# EAGLE design guitar_pedal (EAGLE 6.5.0)

## Sheet 1 of 5: Input
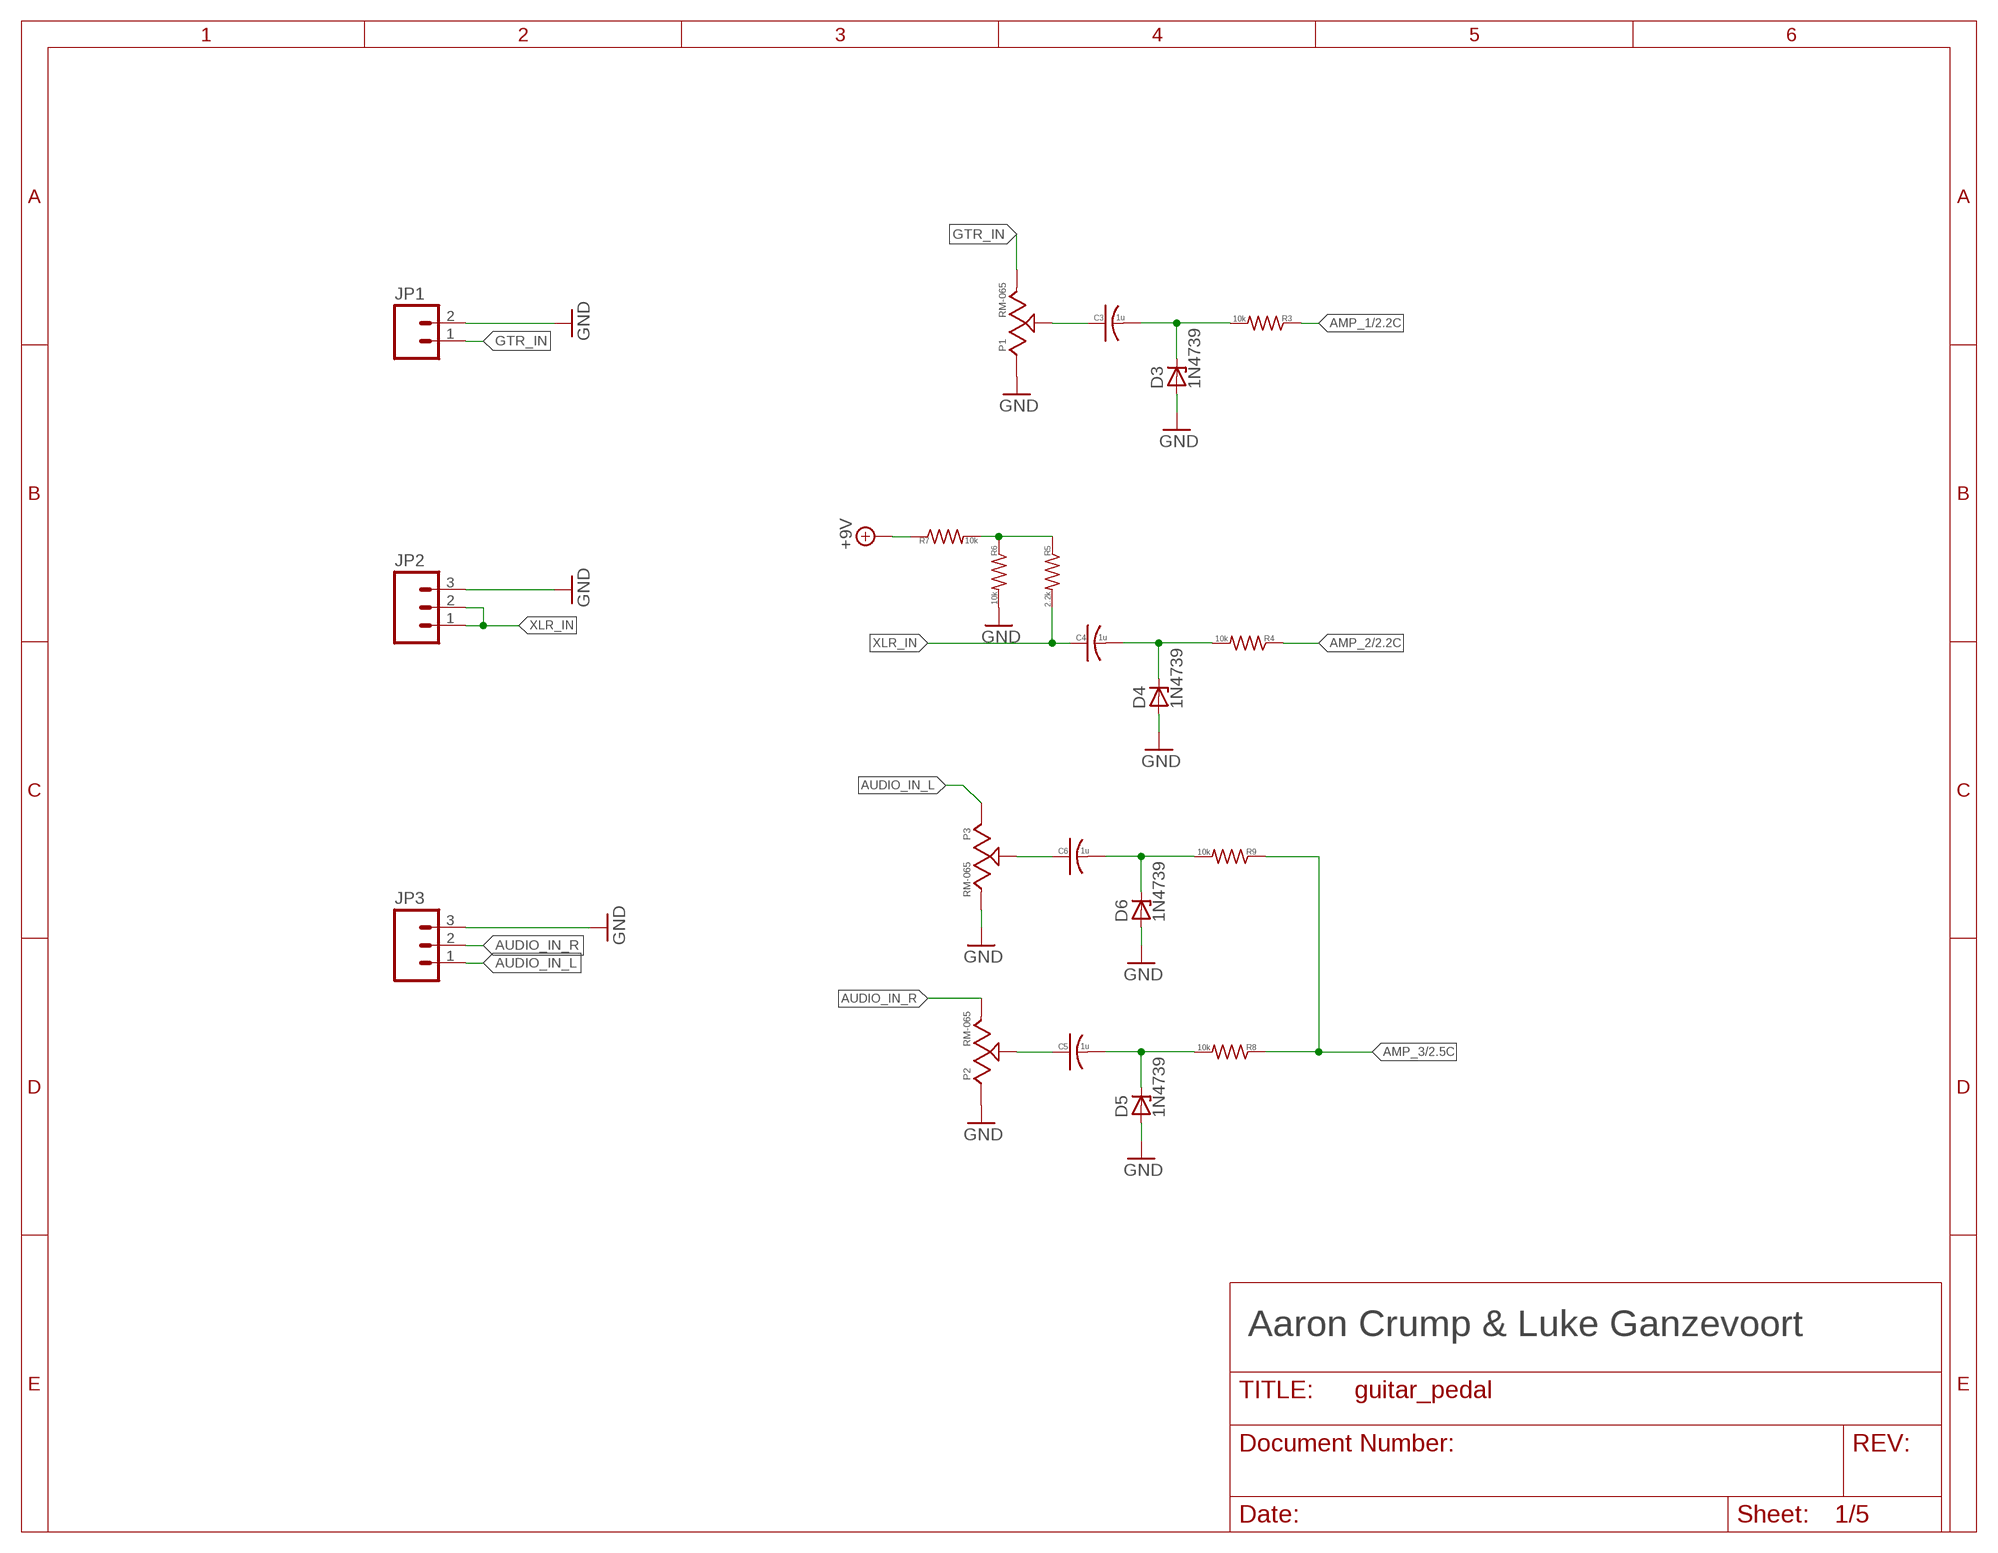
[diagram p0: schematic, sheet 1]

### Parts
C3  1u  CAPACITOR0805  [C0805]
C4  1u  CAPACITOR0805  [C0805]
C5  1u  CAPACITOR0805  [C0805]
C6  1u  CAPACITOR0805  [C0805]
D3  1N4739  1N4728  [DO41-7]
D4  1N4739  1N4728  [DO41-7]
D5  1N4739  1N4728  [DO41-7]
D6  1N4739  1N4728  [DO41-7]
JP1  M02PTH  [1X02]
JP2  M03PTH  [1X03]
JP3  M03PTH  [1X03]
P1  RM-065  [RM-065]
P2  RM-065  [RM-065]
P3  RM-065  [RM-065]
R3  10k  RESISTOR0805  [C0805]
R4  10k  RESISTOR0805  [C0805]
R5  2.2k  RESISTOR0805  [C0805]
R6  10k  RESISTOR0805  [C0805]
R7  10k  RESISTOR0805  [C0805]
R8  10k  RESISTOR0805  [C0805]
R9  10k  RESISTOR0805  [C0805]

### Nets
+9V: R7.1 ; also sheet 2,3,4,5
AMP_1: R3.1 ; also sheet 2
AMP_2: R4.1 ; also sheet 2
AMP_3: R8.1 R9.1 ; also sheet 2
AUDIO_IN_L: JP3.1 P3.1
AUDIO_IN_R: JP3.2 P2.3
GND: D3.A D4.A D5.A D6.A JP1.2 JP2.3 JP3.3 P1.1 P2.1 P3.3 R6.2 ; also sheet 2,3,4,5
GTR_IN: JP1.1 P1.3
N$2: C5.1(POS) P2.2(W)
N$3: R5.1 R6.1 R7.2
N$4: C3.1(POS) P1.2(W)
N$6: C6.1(POS) P3.2(W)
N$24: C4.2(NEG) D4.C R4.2
N$30: C6.2(NEG) D6.C R9.2
N$33: C5.2(NEG) D5.C R8.2
N$37: C3.2(NEG) D3.C R3.2
XLR_IN: C4.1(POS) JP2.1 JP2.2 R5.2

### Notes on the sheet
- Aaron Crump & Luke Ganzevoort

## Sheet 2 of 5: Summing
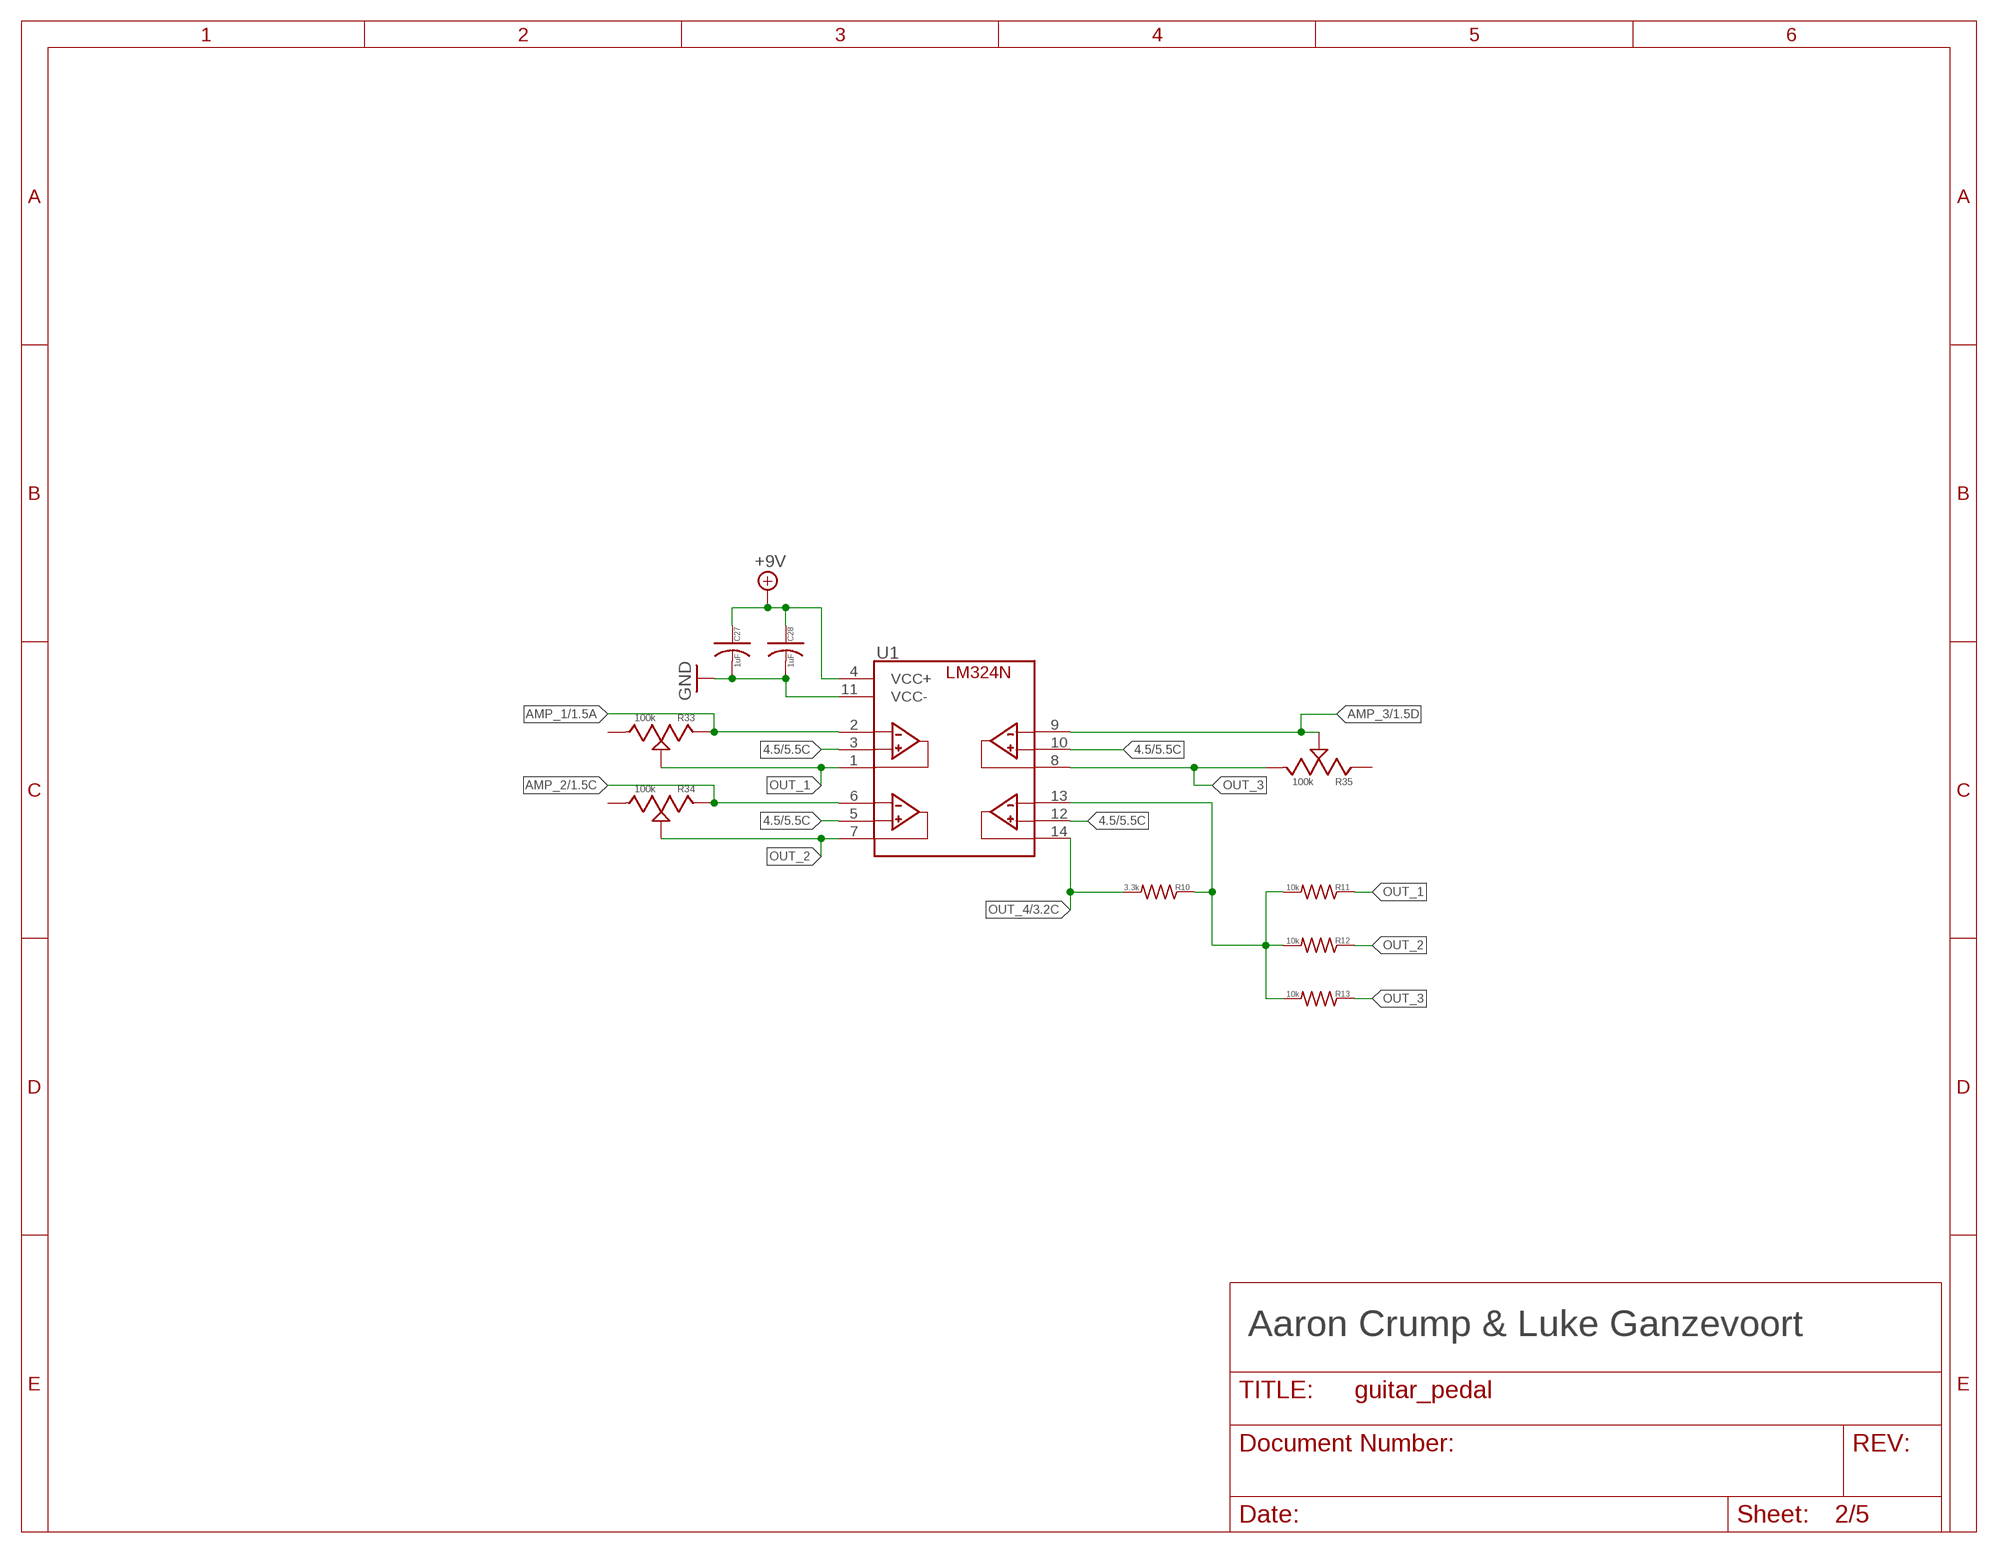
[diagram p1: schematic, sheet 2]

### Parts
C27  1uF  CAPACITOR0805  [C0805]
C28  1uF  CAPACITOR0805  [C0805]
R10  3.3k  RESISTOR0805  [C0805]
R11  10k  RESISTOR0805  [C0805]
R12  10k  RESISTOR0805  [C0805]
R13  10k  RESISTOR0805  [C0805]
R33  100k  POT  [1X03_LONGPADS]
R34  100k  POT  [1X03_LONGPADS]
R35  100k  POT  [1X03_LONGPADS]
U1  LM324NSOIC-14  [SOIC-14]

### Nets
4.5: U1.3(NINV_IN_1) U1.5(NINV_IN_2) U1.10(NINV_3) U1.12(NINV_4) ; also sheet 5
+9V: C27.1(POS) C28.1(POS) U1.4(VCC+) ; also sheet 1,3,4,5
AMP_1: R33.1 U1.2(INV_IN_1) ; also sheet 1
AMP_2: R34.1 U1.6(INV_IN_2) ; also sheet 1
AMP_3: R35.2(W) U1.9(INV_3) ; also sheet 1
GND: C27.2(NEG) C28.2(NEG) U1.11(VCC-) ; also sheet 1,3,4,5
N$7: R10.1 R11.2 R12.2 R13.2 U1.13(INV_4)
OUT_1: R11.1 R33.2(W) U1.1(OUT_1)
OUT_2: R12.1 R34.2(W) U1.7(OUT_2)
OUT_3: R13.1 R35.3 U1.8(OUT_3)
OUT_4: R10.2 U1.14(OUT_4) ; also sheet 3
Unconnected: R33.3 R34.3 R35.1

### Notes on the sheet
- Aaron Crump & Luke Ganzevoort

## Sheet 3 of 5: EQ
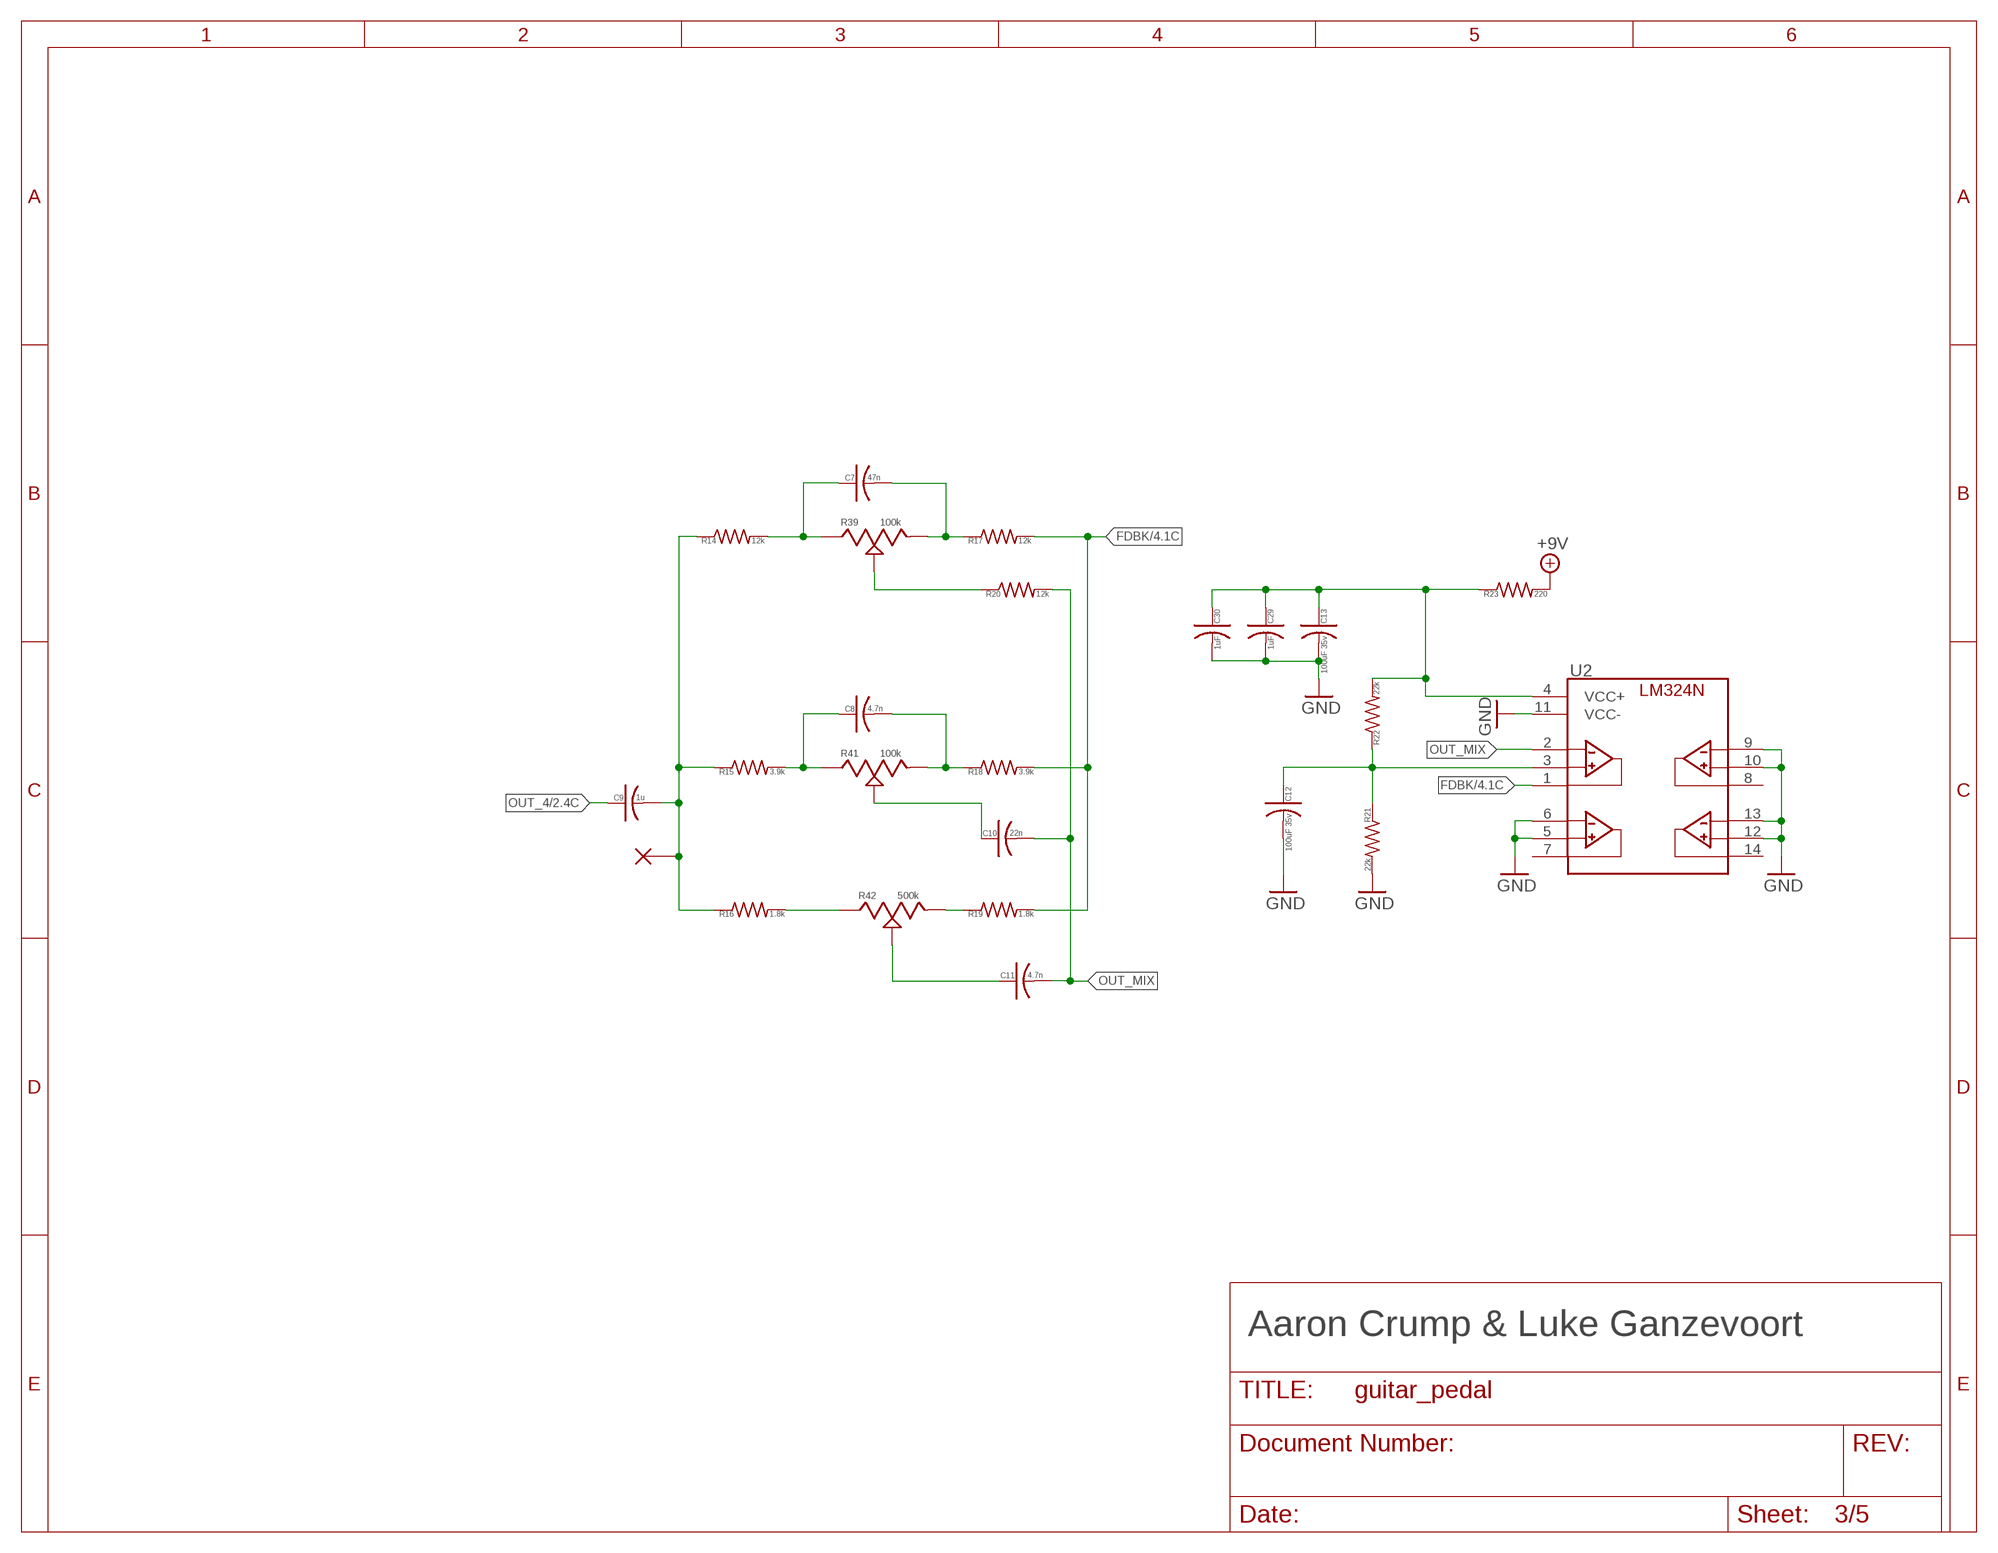
[diagram p2: schematic, sheet 3]

### Parts
C7  47n  CAPACITOR0805  [C0805]
C8  4.7n  CAPACITOR0805  [C0805]
C9  1u  CAPACITOR0805  [C0805]
C10  22n  CAPACITOR0805  [C0805]
C11  4.7n  CAPACITOR0805  [C0805]
C12  100uF 35v  CAPACITORCAN_6MM  [CAN_6MM]
C13  100uF 35v  CAPACITORCAN_6MM  [CAN_6MM]
C29  1uF  CAPACITOR0805  [C0805]
C30  1uF  CAPACITOR0805  [C0805]
R14  12k  RESISTOR0805  [C0805]
R15  3.9k  RESISTOR0805  [C0805]
R16  1.8k  RESISTOR0805  [C0805]
R17  12k  RESISTOR0805  [C0805]
R18  3.9k  RESISTOR0805  [C0805]
R19  1.8k  RESISTOR0805  [C0805]
R20  12k  RESISTOR0805  [C0805]
R21  22k  RESISTOR0805  [C0805]
R22  22k  RESISTOR0805  [C0805]
R23  220  RESISTOR0805  [C0805]
R39  100k  POT  [1X03_LONGPADS]
R41  100k  POT  [1X03_LONGPADS]
R42  500k  POT  [1X03_LONGPADS]
U2  LM324NSOIC-14  [SOIC-14]
V2  EQin  VIA1  [VIA1]

### Nets
+9V: R23.2 ; also sheet 1,2,4,5
FDBK: R17.2 R18.2 R19.2 U2.1(OUT_1) ; also sheet 4
GND: C12.P-(NEG) C13.P-(NEG) C29.2(NEG) C30.2(NEG) R21.2 U2.5(NINV_IN_2) U2.6(INV_IN_2) U2.9(INV_3) U2.10(NINV_3) U2.11(VCC-) U2.12(NINV_4) U2.13(INV_4) ; also sheet 1,2,4,5
N$5: C13.P+(POS) C29.1(POS) C30.1(POS) R22.2 R23.1 U2.4(VCC+)
N$9: C7.1(POS) R14.2 R39.1
N$10: C8.1(POS) R15.2 R41.1
N$11: R16.2 R42.1
N$12: C9.2(NEG) R14.1 R15.1 R16.1 V2.P$1
N$13: C11.1(POS) R42.2(W)
N$15: C7.2(NEG) R17.1 R39.3
N$16: C8.2(NEG) R18.1 R41.3
N$17: R19.1 R42.3
N$18: R20.1 R39.2(W)
N$19: C10.1(POS) R41.2(W)
N$26: C12.P+(POS) R21.1 R22.1 U2.3(NINV_IN_1)
OUT_4: C9.1(POS) ; also sheet 2
OUT_MIX: C10.2(NEG) C11.2(NEG) R20.2 U2.2(INV_IN_1)
Unconnected: U2.7(OUT_2) U2.8(OUT_3) U2.14(OUT_4)

### Notes on the sheet
- Aaron Crump & Luke Ganzevoort

## Sheet 4 of 5: Outputs
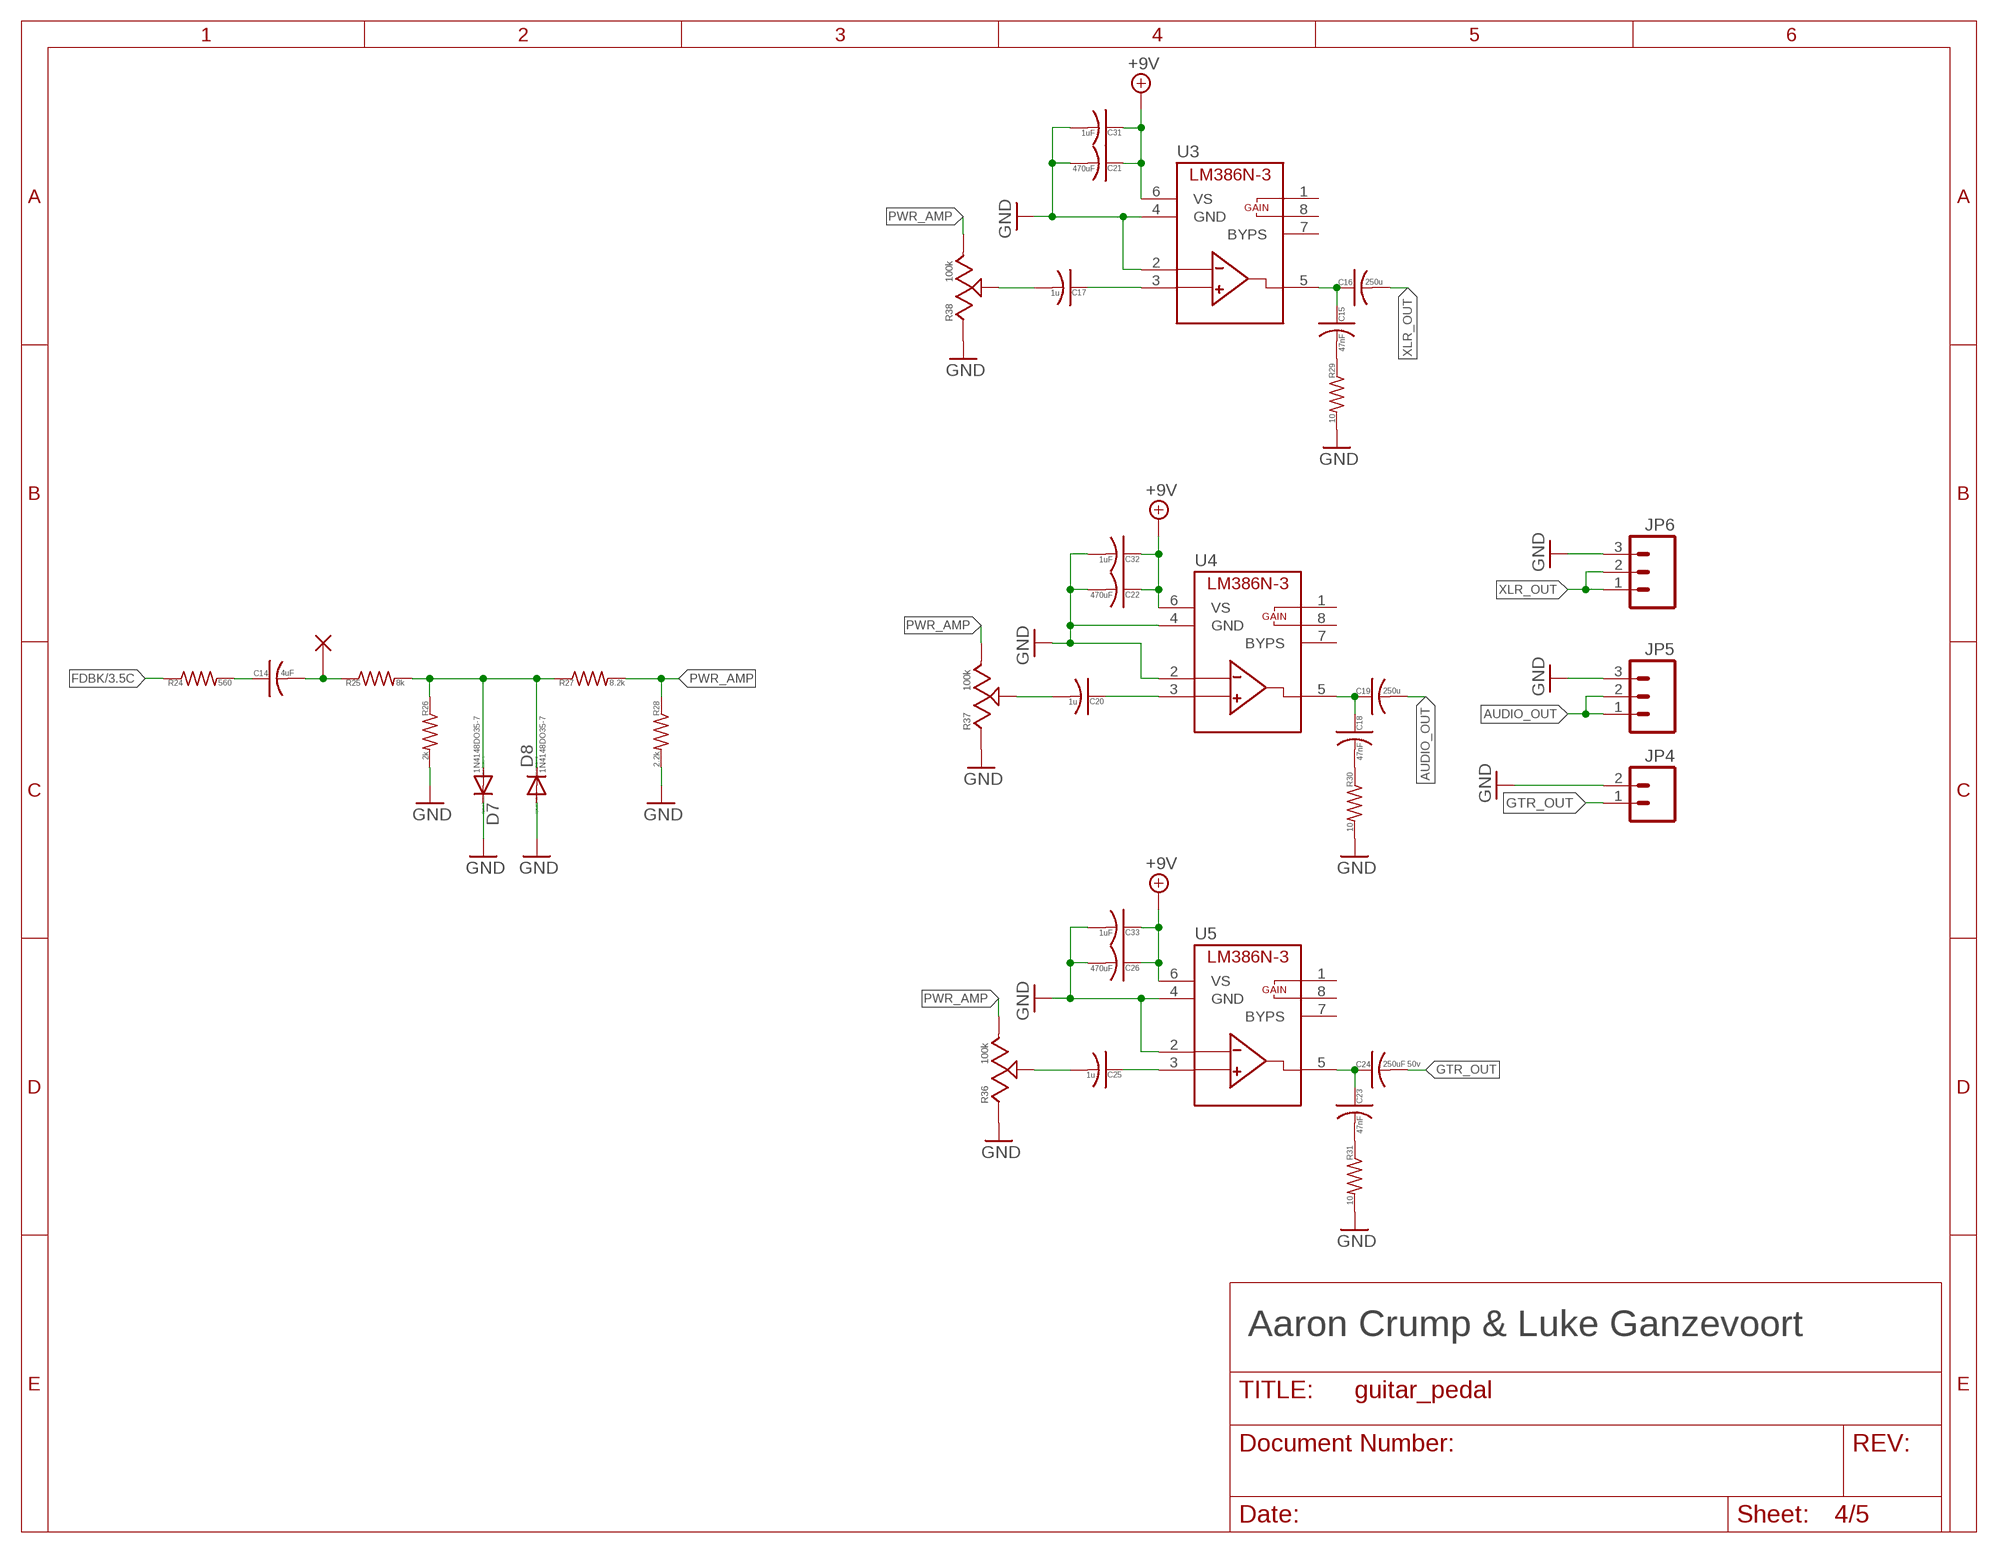
[diagram p3: schematic, sheet 4]

### Parts
C14  4uF  CAPACITOR0805  [C0805]
C15  47nF  CAPACITOR0805  [C0805]
C16  250u  CAP_CAN01  [CAN01]
C17  1u  CAPACITOR0805  [C0805]
C18  47nF  CAPACITOR0805  [C0805]
C19  250u  CAP_CAN01  [CAN01]
C20  1u  CAPACITOR0805  [C0805]
C21  470uF  CAP_CAN01  [CAN01]
C22  470uF  CAP_CAN01  [CAN01]
C23  47nF  CAPACITOR0805  [C0805]
C24  250uF 50v  CAP_CAN01  [CAN01]
C25  1u  CAPACITOR0805  [C0805]
C26  470uF  CAP_CAN01  [CAN01]
C31  1uF  CAPACITOR0805  [C0805]
C32  1uF  CAPACITOR0805  [C0805]
C33  1uF  CAPACITOR0805  [C0805]
D7  1N4148DO35-7  [DO35-7]
D8  1N4148DO35-7  [DO35-7]
JP4  M02PTH  [1X02]
JP5  M03PTH  [1X03]
JP6  M03PTH  [1X03]
R24  560  RESISTOR0805  [C0805]
R25  8k  RESISTOR0805  [C0805]
R26  2k  RESISTOR0805  [C0805]
R27  8.2k  RESISTOR0805  [C0805]
R28  2.2k  RESISTOR0805  [C0805]
R29  10  RESISTOR0805  [C0805]
R30  10  RESISTOR0805  [C0805]
R31  10  RESISTOR0805  [C0805]
R36  100k  POT  [1X03_LONGPADS]
R37  100k  POT  [1X03_LONGPADS]
R38  100k  POT  [1X03_LONGPADS]
U3  LM386N-3  [DIL08]
U4  LM386N-3  [DIL08]
U5  LM386N-3  [DIL08]
V17  EQout  VIA1  [VIA1]

### Nets
+9V: C21.+(POS) C22.+(POS) C26.+(POS) C31.1(POS) C32.1(POS) C33.1(POS) U3.6(VS) U4.6(VS) U5.6(VS) ; also sheet 1,2,3,5
AUDIO_OUT: C19.-(NEG) JP5.1 JP5.2
FDBK: R24.1 ; also sheet 3
GND: C21.-(NEG) C22.-(NEG) C26.-(NEG) C31.2(NEG) C32.2(NEG) C33.2(NEG) D7.C D8.A JP4.2 JP5.3 JP6.3 R26.2 R28.2 R29.2 R30.2 R31.2 R36.1 R37.1 R38.1 U3.2(-IN) U3.4(GND) U4.2(-IN) U4.4(GND) U5.2(-IN) U5.4(GND) ; also sheet 1,2,3,5
GTR_OUT: C24.-(NEG) JP4.1
N$8: C15.1(POS) C16.+(POS) U3.5(VOUT)
N$14: C14.1(POS) R24.2
N$20: C14.2(NEG) R25.1 V17.P$1
N$21: D7.A D8.C R25.2 R26.1 R27.1
N$22: C15.2(NEG) R29.1
N$23: C17.2(NEG) R38.2(W)
N$25: C18.1(POS) C19.+(POS) U4.5(VOUT)
N$27: C20.1(POS) U4.3(+IN)
N$28: C17.1(POS) U3.3(+IN)
N$29: C18.2(NEG) R30.1
N$31: C20.2(NEG) R37.2(W)
N$34: C23.1(POS) C24.+(POS) U5.5(VOUT)
N$35: C25.1(POS) U5.3(+IN)
N$36: C23.2(NEG) R31.1
N$38: C25.2(NEG) R36.2(W)
PWR_AMP: R27.2 R28.1 R36.3 R37.3 R38.3
XLR_OUT: C16.-(NEG) JP6.1 JP6.2
Unconnected: U3.1(GN) U3.7(BYPS) U3.8(GN2) U4.1(GN) U4.7(BYPS) U4.8(GN2) U5.1(GN) U5.7(BYPS) U5.8(GN2)

### Notes on the sheet
- Aaron Crump & Luke Ganzevoort

## Sheet 5 of 5: Power
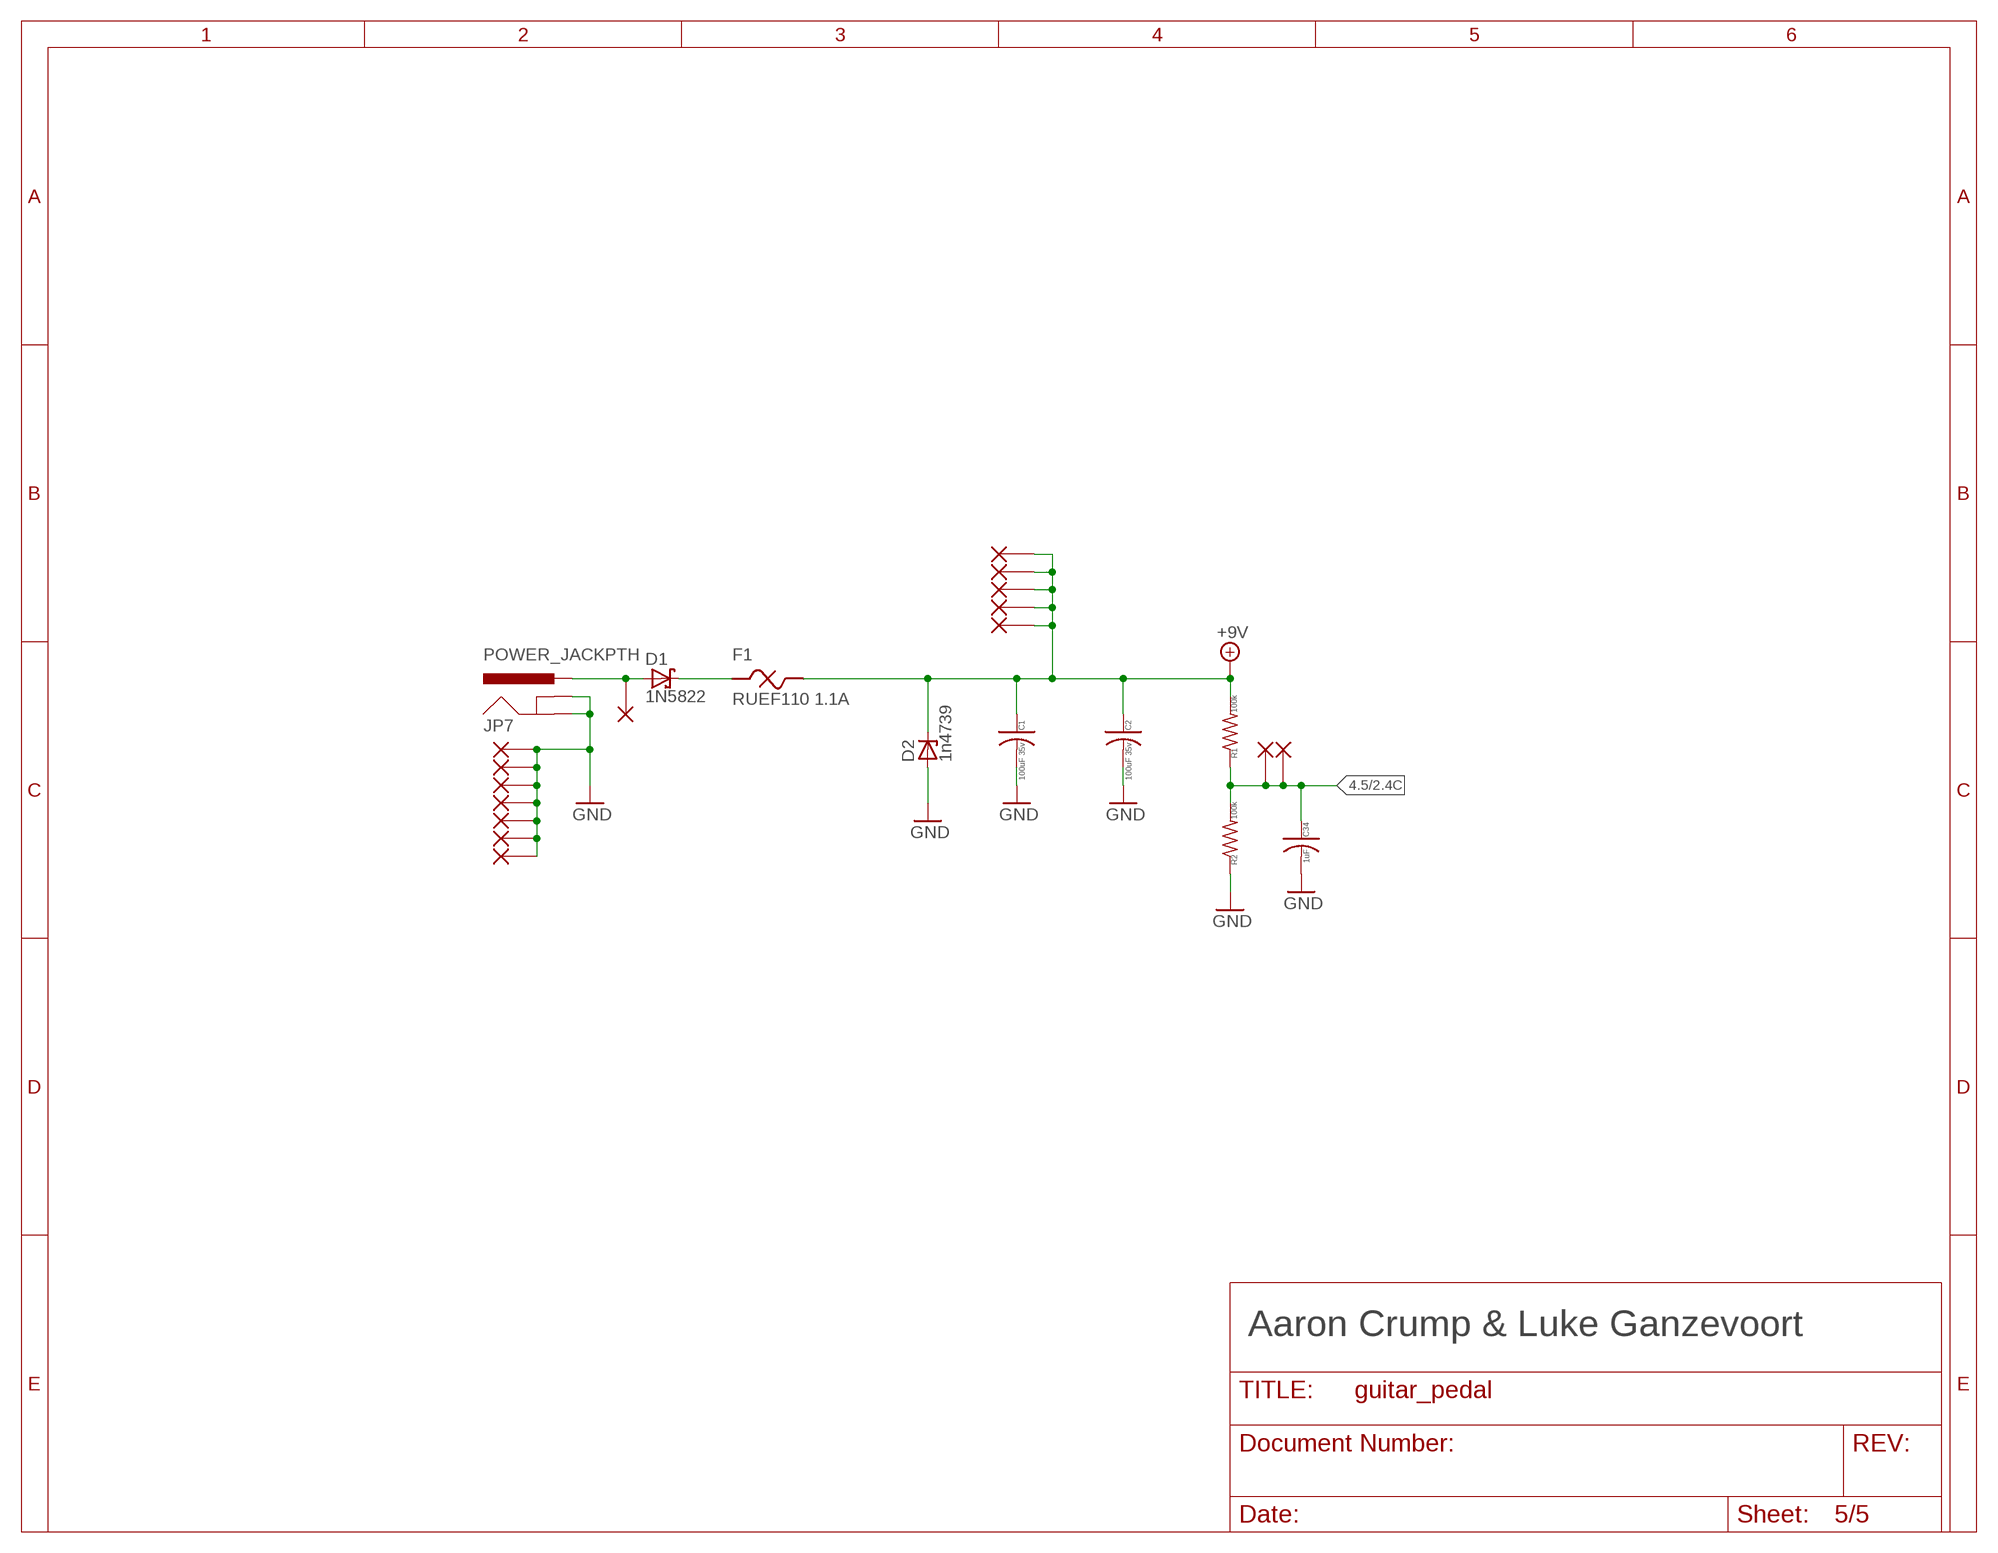
[diagram p4: schematic, sheet 5]

### Parts
C1  100uF 35v  CAPACITORCAN_6MM  [CAN_6MM]
C2  100uF 35v  CAPACITORCAN_6MM  [CAN_6MM]
C34  1uF  CAPACITOR0805  [C0805]
D1  1N5822  [DO201T15]
D2  1n4739  1N4728  [DO41-7]
F1  RUEF110 1.1A  PTCRUEF110  [RADIAL_PTC_RUEF110]
JP7  POWER_JACKPTH  [POWER_JACK_PTH]
R1  100k  RESISTOR0805  [C0805]
R2  100k  RESISTOR0805  [C0805]
V1  V+  VIA1  [VIA1]
V3  9v  VIA1  [VIA1]
V4  9v  VIA1  [VIA1]
V5  9v  VIA1  [VIA1]
V6  9v  VIA1  [VIA1]
V7  9v  VIA1  [VIA1]
V8  4v5  VIA1  [VIA1]
V9  4v5  VIA1  [VIA1]
V10  GND  VIA1  [VIA1]
V11  GND  VIA1  [VIA1]
V12  GND  VIA1  [VIA1]
V13  GND  VIA1  [VIA1]
V14  GND  VIA1  [VIA1]
V15  GND  VIA1  [VIA1]
V16  GND  VIA1  [VIA1]

### Nets
4.5: C34.1(POS) R1.1 R2.2 V8.P$1 V9.P$1 ; also sheet 2
+9V: C1.P+(POS) C2.P+(POS) D2.C F1.P$2 R1.2 V3.P$1 V4.P$1 V5.P$1 V6.P$1 V7.P$1 ; also sheet 1,2,3,4
GND: C1.P-(NEG) C2.P-(NEG) C34.2(NEG) D2.A JP7.GND JP7.GNDBREAK R2.1 V10.P$1 V11.P$1 V12.P$1 V13.P$1 V14.P$1 V15.P$1 V16.P$1 ; also sheet 1,2,3,4
N$1: D1.A JP7.PWR V1.P$1
N$32: D1.C F1.P$1

### Notes on the sheet
- Aaron Crump & Luke Ganzevoort

## Library data of the parts
C1-C15 C17 C18 C20 C23 C25 C27-C34 = Luke:CAPACITOR
C16 C19 C21 C22 C24 C26 = Luke:CAP_CAN01
D1 = aarons:1N5822
D2-D6 = aarons:1N4728
D7 D8 = diode:1N4148: DIODE high speed (Philips)
F1 = Luke:PTC
JP1 JP4 = SparkFun-Connectors:M02: Standard 2-pin 0.1" header. Use with - straight break away headers ( PRT-00116) - right angle break away headers (PRT-00553) - swiss pins (PRT-00743) - machine pins (PRT-00117) - female headers (PRT-00115) Molex polarized connector foot print use with: PRT-08233 with associated crimp pins and housings. 2.54_SCREWTERM for use with PRT-10571. 3.5mm Screw Terminal footprints for PRT-08084 5mm Screw Terminal footprints for use with PRT-08432
JP2 JP3 JP5 JP6 = SparkFun-Connectors:M03: Header 3 Standard 3-pin 0.1" header. Use with straight break away headers (SKU : PRT-00116), right angle break away headers (PRT-00553), swiss pins (PRT-00743), machine pins (PRT-00117), and female headers (PRT-00115). Molex polarized connector foot print use with SKU : PRT-08232 with associated crimp pins and housings.
JP7 = SparkFun-Connectors:POWER_JACK: Power Jack This is the standard 5.5mm barrel jack for power. The PTH is the most common, proven, reliable, footprint. The Slot footprint only works if the mill layer is transmitted to the PCB fab house so be warned. Mating wall wart : TOL-00298 (and others); PROD_ID: CONN-08197
P1-P3 = aarons:RM-065
R1-R31 = Luke:RESISTOR
R33-R39 R41 R42 = aarons:POT
U1 U2 = aarons:LM324N
U3-U5 = aarons:LM386N-3
V1-V17 = Luke:VIA1

## Board
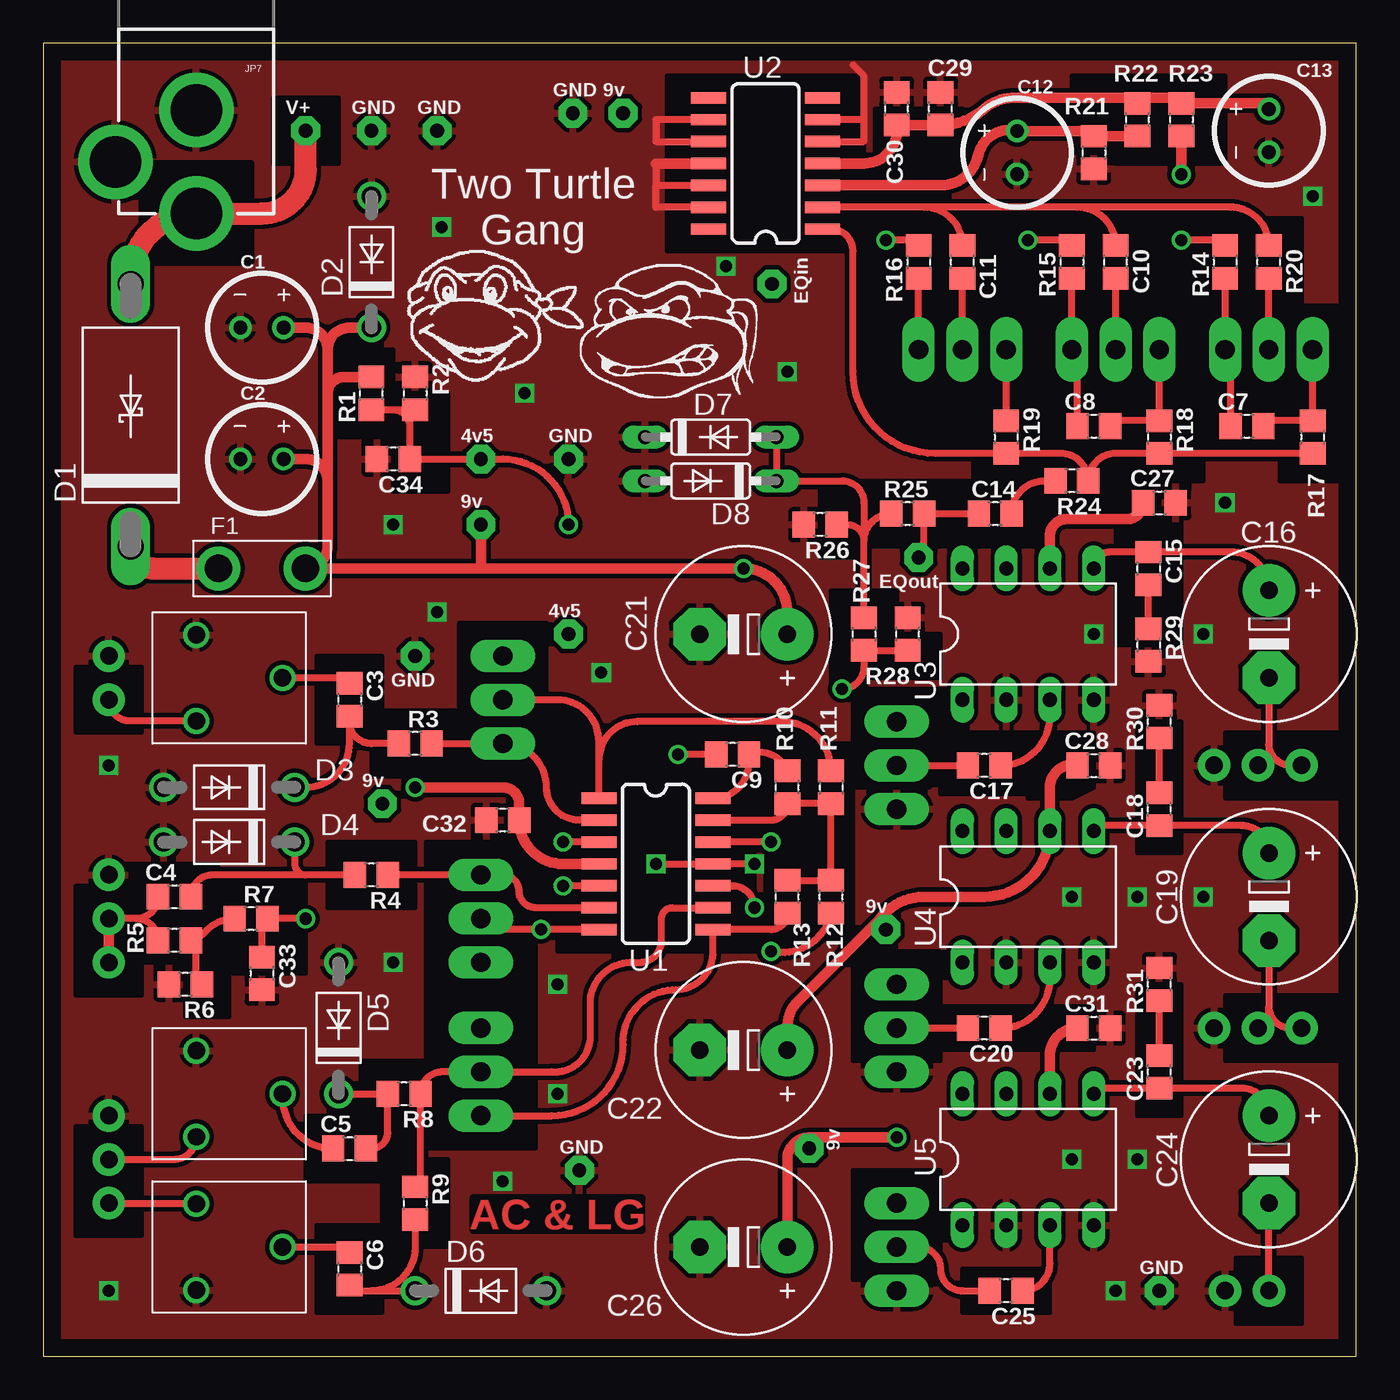
[diagram p5: board, top side]
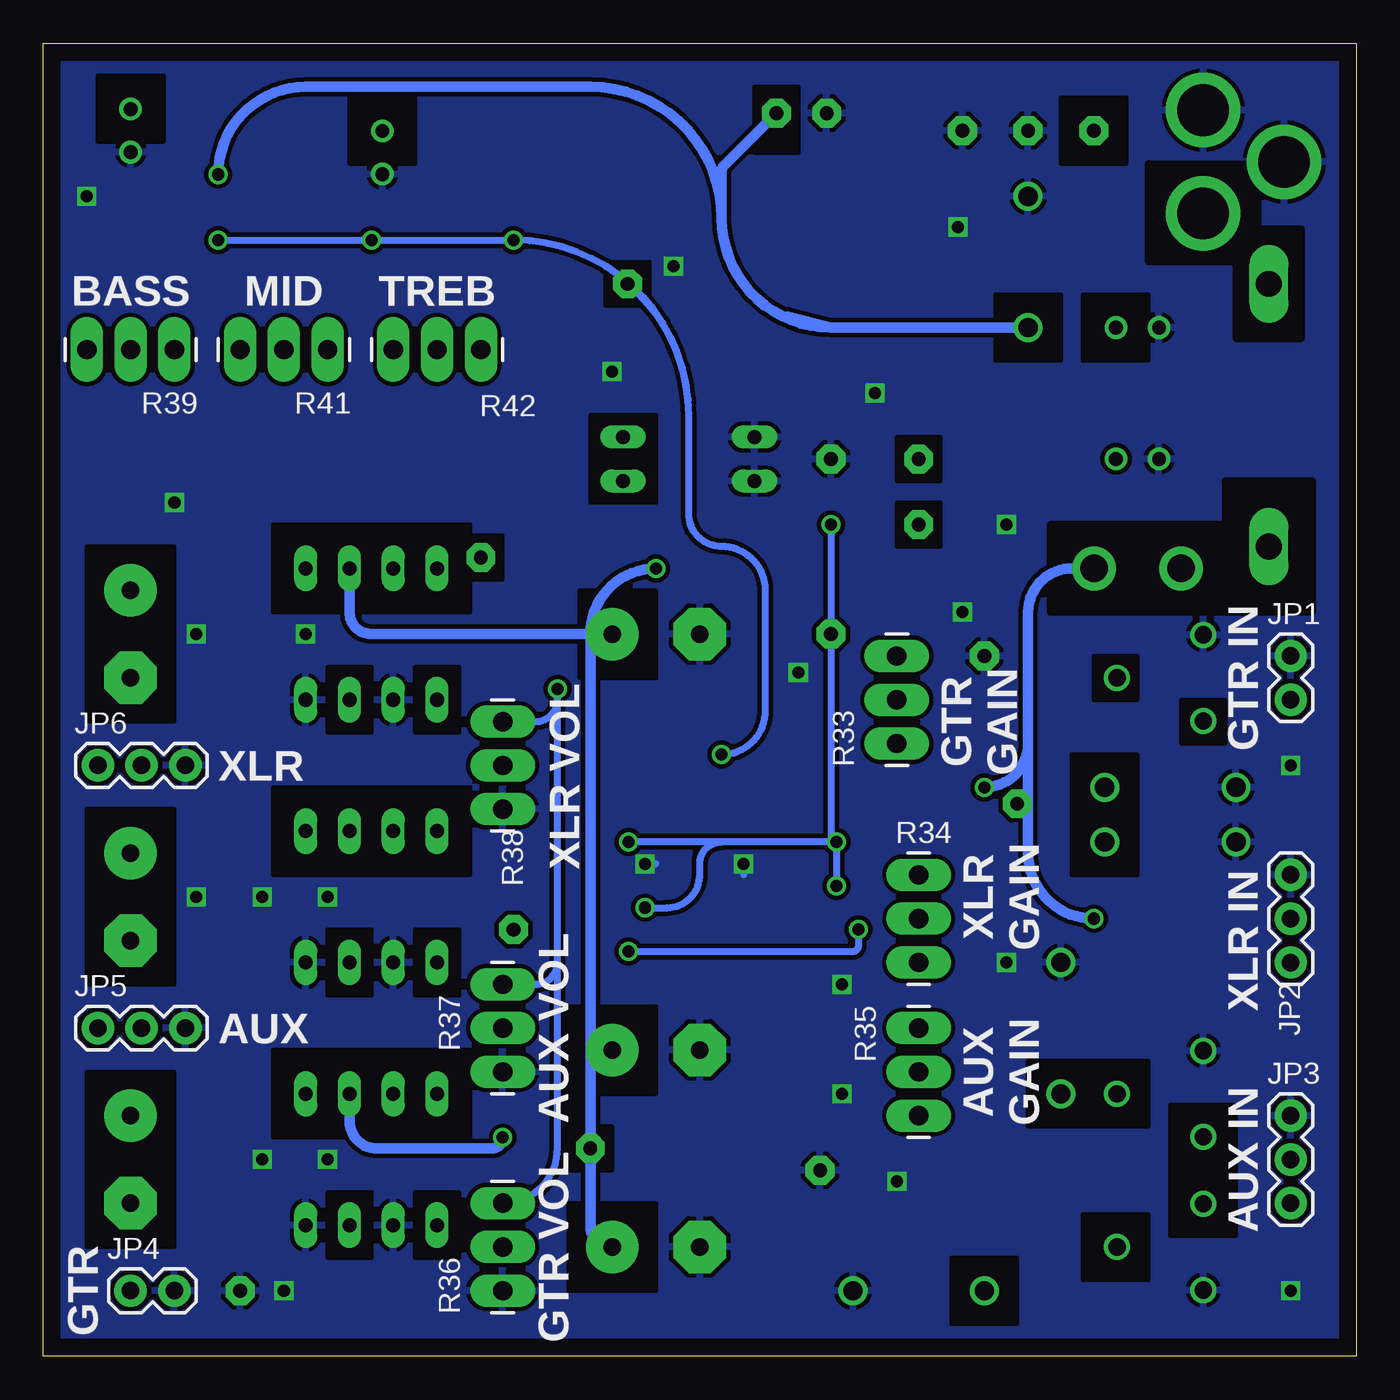
[diagram p6: board, bottom side, seen from below]

Size 76.2 x 76.2 mm. Coordinates in mm from the lower left corner, seen from the top.
Outline: 0,0 76.2,0 76.2,76.2 0,76.2 0,0
Copper layers (1*16): Top 0.035mm / dielectric 1.5mm / Bottom 0.035mm
Design rules "default *": minimum track width 10mil, minimum drill 24mil, track to track 10mil, track to pad 10mil, pad to pad 10mil, via to via 10mil, smd to smd 10mil, copper to edge 40mil, drill to drill 10mil, minimum pad ring 10mil, minimum via ring 8mil, stop-mask expansion 4mil, vias tented up to drill 0mil, thermal gap 10mil

### Footprints (pad centres in the part's own frame; a part is rotated, then mirrored left to right if it is on the bottom)
CAN_6MM = drill 0.8: P+ 1.25,0; P- -1.25,0
C0805 = smd 1.3 x 1.5: 1 -0.95,0; 2 0.95,0
CAN01 = drill 1.016 pad 3.048: + -2.54,0 | drill 1.016 pad 3.048 octagon: - 2.54,0
DO201T15 = drill 1.499 long: A 7.62,0; C -7.62,0
DO41-7 = drill 1.118: A 3.81,0; C -3.81,0
DO35-7 = drill 0.813 long: A 3.81,0; C -3.81,0
RADIAL_PTC_RUEF110 = drill 1.6 pad 2.54: P$1 -2.525,0; P$2 2.525,0
1X02 = drill 1.016 pad 1.88: 1 0,0; 2 2.54,0
1X03 = drill 1.016 pad 1.88: 1 0,0; 2 2.54,0; 3 5.08,0
POWER_JACK_PTH = drill 2.997 pad 4.318: GND 0,7.7; GNDBREAK 4.7,10.7; PWR 0,13.7
RM-065 = drill 1: 1 -2.5,0; 2 0,5; 3 2.5,0
1X03_LONGPADS = drill 1.118 pad 1.88 long: 1 0,0; 2 2.54,0; 3 5.08,0
SOIC-14 = smd 0.66 x 2.032: 1 -4.445,-3.315; 2 -3.175,-3.315; 3 -1.905,-3.315; 4 -0.635,-3.315; 5 0.635,-3.315; 6 1.905,-3.315; 7 3.175,-3.315; 8 3.175,3.315; 9 1.905,3.315; 10 0.635,3.315; 11 -0.635,3.315; 12 -1.905,3.315; 13 -3.175,3.315; 14 -4.445,3.315
DIL08 = drill 0.813 long: 1 -3.81,-3.81; 2 -1.27,-3.81; 3 1.27,-3.81; 4 3.81,-3.81; 5 3.81,3.81; 6 1.27,3.81; 7 -1.27,3.81; 8 -3.81,3.81
VIA1 = drill 0.8 pad 1.676 octagon: P$1 0,0

### Placement (x,y rotation side)
C1  12.7,59.69 0 top
C2  12.7,52.07 0 top
C3  17.78,38.1 270 top
C4  7.62,26.67 0 top
C5  17.78,12.06 0 top
C6  17.78,5.08 270 top
C7  69.85,53.98 0 top
C8  60.96,53.98 0 top
C9  40.01,34.92 180 top
C10  62.23,63.5 90 top
C11  53.34,63.5 90 top
C12  56.52,69.85 90 top
C13  71.12,71.12 90 top
C14  55.24,48.9 180 top
C15  64.14,45.72 270 top
C16  71.12,41.91 270 top
C17  54.61,34.29 180 top
C18  64.77,31.75 90 top
C19  71.12,26.67 270 top
C20  54.61,19.05 180 top
C21  40.64,41.91 180 top
C22  40.64,17.78 180 top
C23  64.77,16.51 90 top
C24  71.12,11.43 270 top
C25  55.88,3.81 180 top
C26  40.64,6.35 180 top
C27  64.77,49.53 0 top
C28  60.96,34.29 0 top
C29  52.07,72.39 90 top
C30  49.53,72.39 90 top
C31  60.96,19.05 0 top
C32  26.67,31.11 180 top
C33  12.7,22.23 270 top
C34  20.32,52.07 180 top
D1  5.08,54.61 90 top
D2  19.05,63.5 90 top
D3  10.79,33.02 180 top
D4  10.79,29.84 180 top
D5  17.14,19.05 90 top
D6  25.4,3.81 0 top
D7  38.73,53.34 0 top
D8  38.73,50.8 180 top
F1  12.7,45.72 0 top
JP1  3.81,38.1 90 bottom
JP2  3.81,22.86 90 bottom
JP3  3.81,8.89 90 bottom
JP4  71.12,3.81 0 bottom
JP5  73.03,19.05 0 bottom
JP6  73.03,34.29 0 bottom
JP7  8.89,80.01 180 top
P1  8.89,39.37 270 top
P2  8.89,15.24 270 top
P3  8.89,6.35 270 top
R1  19.05,55.88 90 top
R2  21.59,55.88 270 top
R3  21.59,35.56 180 top
R4  19.05,27.94 180 top
R5  7.62,24.13 180 top
R6  8.26,21.59 180 top
R7  12.06,25.4 180 top
R8  20.95,15.24 180 top
R9  21.59,8.89 270 top
R10  43.18,33.02 90 top
R11  45.72,33.02 270 top
R12  45.72,26.67 90 top
R13  43.18,26.67 90 top
R14  68.58,63.5 270 top
R15  59.69,63.5 270 top
R16  50.8,63.5 270 top
R17  73.66,53.34 270 top
R18  64.77,53.34 270 top
R19  55.88,53.34 270 top
R20  71.12,63.5 90 top
R21  60.96,69.85 270 top
R22  63.5,71.75 90 top
R23  66.04,71.75 270 top
R24  59.69,50.8 180 top
R25  50.16,48.9 180 top
R26  45.09,48.26 180 top
R27  47.62,41.91 270 top
R28  50.16,41.91 90 top
R29  64.14,41.27 270 top
R30  64.77,36.83 90 top
R31  64.77,21.59 90 top
R33  26.67,35.56 90 bottom
R34  25.4,27.94 270 bottom
R35  25.4,19.05 270 bottom
R36  49.53,3.81 90 bottom
R37  49.53,16.51 90 bottom
R38  49.53,31.75 90 bottom
R39  68.58,58.42 180 bottom
R41  59.69,58.42 180 bottom
R42  50.8,58.42 180 bottom
U1  35.56,27.94 270 top
U2  41.91,69.85 90 top
U3  57.15,41.91 0 top
U4  57.15,26.67 0 top
U5  57.15,11.43 0 top
U$1  [NINJA_TURTLE1]  30.99,55.12 0 top
U$2  [NINJA_TURTLE2]  20.32,55.88 0 top
V1  15.24,71.12 0 top
V2  42.29,62.23 270 top
V3  48.9,24.77 0 top
V4  44.45,12.06 270 top
V5  33.66,72.14 0 top
V6  19.68,32.07 0 top
V7  25.4,48.26 0 top
V8  30.48,41.91 0 top
V9  25.4,52.07 0 top
V10  31.11,10.79 0 top
V11  21.59,40.64 180 top
V12  30.48,52.07 0 top
V13  30.73,72.14 0 top
V14  64.77,3.81 0 top
V15  22.86,71.12 0 top
V16  19.05,71.12 0 top
V17  50.8,46.35 180 top

### Tracks (layer width: path | path; a pad name or v marks a point on that pad's centre or on a via)
4.5  (via drill 0.7)
  Top 0.406: U1.5 v30.16,27.3 | U1.3 v30.16,29.84 | v42.23,29.84 U1.12 | R2.2 R1.1 20.32,54.93 arc-90 21.27,53.98 C34.1 V9.P$1 26.67,52.07 arc-90 v30.48,48.26 | 39.96,27.3 U1.10 40.01,27.3 arc-90 v41.27,26.04
  Bottom 0.406: v30.16,29.84 36.83,29.84 | 36.83,29.84 v42.23,29.84 | v30.16,29.84 v30.16,27.3 | v30.48,48.26 V8.P$1 30.48,30.16 arc-90 v30.16,29.84 | v41.27,26.04 40.01,26.04 arc-90 38.1,27.94 38.1,28.57 arc90 36.83,29.84
+9V  (via drill 0.7)
  Top 0.254: 48.58,25.4 48.9,25.4 V3.P$1 | 44.45,12.7 V4.P$1
  Top 0.406: C33.1 12.7,25.4 R7.1 v15.24,25.4
  Top 0.61: 16.51,50.8 16.51,47.01 arc-90 F1.P$2 25.4,45.72 | 16.51,50.8 16.51,55.88 | 16.51,55.88 16.51,58.42 | 16.51,58.42 arc-90 17.78,59.69 D2.C | C1.P+ 15.24,59.69 arc-90 16.51,58.42 | R1.2 17.46,56.83 arc90 16.51,55.88 | C2.P+ 15.24,52.07 arc-90 16.51,50.8 | U1.4 30.16,28.57 arc-90 C32.1 27.62,32.07 arc90 26.67,33.02 v21.59,33.02 | v49.53,12.7 44.45,12.7 arc90 43.18,11.43 C26.+ | U5.6 58.42,17.46 arc-90 C31.1 | C28.1 arc103 58.42,33.02 U4.6 arc-90 54.61,26.67 51.12,26.67 arc53 48.58,25.4 43.81,20.64 arc46 43.18,19.05 C22.+ | C27.1 arc-90 62.87,48.58 59.37,48.58 arc90 58.42,47.62 U3.6 | 25.4,45.72 v40.64,45.72 arc-90 43.18,43.18 C21.+ | R23.2 v66.04,68.58 | V7.P$1 25.4,45.72
  Bottom 0.61: v21.59,33.02 arc-90 19.05,35.56 | 19.05,35.56 19.05,43.18 arc90 16.51,45.72 F1.P$2 | v15.24,25.4 arc90 19.05,29.21 19.05,32.07 | 19.05,32.07 19.05,35.56 | U5.6 58.42,13.65 arc-90 56.83,12.06 50.16,12.06 arc-90 v49.53,12.7 | U3.6 58.42,43.18 arc-90 57.15,41.91 44.45,41.91 | C22.+ arc90 44.45,19.05 | 44.45,19.05 44.45,41.91 | 44.45,41.91 arc90 v40.64,45.72 | C26.+ arc90 44.45,7.62 44.45,19.05 | v66.04,68.58 arc90 60.96,73.66 44.45,73.66 arc90 36.83,66.04 | 36.83,66.04 arc-90 30.48,59.69 | 30.48,59.69 D2.C | V6.P$1 19.05,32.07 | 33.02,60.33 30.48,59.69 | V5.P$1 36.72,69.07 arc-45 36.83,68.54 36.83,66.04
AMP_1
  Top 0.406: U1.2 31.11,31.11 arc-90 29.21,33.02 arc90 R33.1 R3.1
AMP_2
  Top 0.406: U1.6 28.57,26.04 arc-90 27.62,26.99 arc90 26.67,27.94 R34.1 R4.1
AMP_3
  Top 0.406: R9.1 arc90 21.91,10.15 R8.1 arc-90 23.18,16.51 R35.2 29.53,16.51 arc90 31.75,18.41 31.75,20.64 arc-90 34.29,22.86 34.61,22.86 arc90 35.88,24.13 35.88,25.4 arc-90 36.51,26.04 U1.9
AUDIO_IN_L
  Top 0.406: JP3.1 8.85,8.89 arc-90 P3.1
AUDIO_IN_R
  Top 0.406: JP3.2 7.58,11.43 arc90 P2.3
AUDIO_OUT
  Top 0.406: JP5.1 72.39,19.05 arc-90 71.12,20.32 | C19.- 71.12,20.32 | JP5.2 arc90 71.12,19.68 71.12,20.32
FDBK
  Top 0.406: R17.2 R18.2 62.23,52.39 arc90 R24.1 arc90 59.05,52.39 R19.2 51.75,52.39 arc-90 46.99,57.15 46.99,64.14 arc90 45.72,65.41 U2.1
GND  (via drill 0.7)
  Top 0.406: U2.9 35.56,71.75 35.56,70.48 U2.10 | 35.56,69.22 35.56,67.94 | 35.56,67.94 U2.12 | U2.13 35.56,66.67 35.56,67.94 | U2.5 47.62,70.48 47.62,71.75 | 47.62,71.75 U2.6 | v41.27,28.57 U1.11 v35.56,28.57 | 47.62,71.75 47.62,74.3 46.99,74.93
  Top 0.61: U2.11 35.56,69.22
  Bottom 0.406: v35.56,28.57 35.56,27.94 | v41.27,28.57 40.64,28.57
  other vias: 23.11,65.53 27.94,55.88 20.32,48.26 3.81,34.29 20.32,22.86 26.67,10.16 3.81,3.81 62.23,3.81 63.5,26.67 59.69,26.67 63.5,11.43 59.69,11.43 67.31,26.67 67.31,41.91 60.96,41.91 68.58,49.53 43.18,57.15 39.62,63.25 22.86,43.18 29.84,21.59 32.38,39.69 29.84,15.24 73.66,67.31
  pour Bottom: 0,0 76.2,0 76.2,76.2 0,76.2
  pour Top: 0,0 76.2,0 76.2,76.2 0,76.2
GTR_IN
  Top 0.406: P1.3 5.04,36.87 arc-90 JP1.1
GTR_OUT
  Top 0.406: JP4.1 C24.-
N$1
  Top 1.27: D1.A 5.08,62.5 arc-90 JP7.PWR 12.7,66.31 arc90 15.24,68.85 V1.P$1
N$2
  Top 0.406: P2.2 13.89,15.01 arc90 C5.1
N$3
  Top 0.406: R6.1 8.89,21.59 8.89,23.81 R5.1 8.89,24.13 9.48,24.73 arc-45 R7.2
N$4
  Top 0.406: C3.1 17.46,39.37 P1.2
N$5
  Top 0.61: U2.4 47.62,69.22 arc90 49.53,71.12 | 49.53,71.12 arc-90 49.85,71.44 C29.1 arc41 54.61,72.39 arc-38 56.2,73.03 63.5,73.03 | 49.53,71.12 C30.1 | R22.2 63.5,73.03 | 63.5,73.03 66.04,73.03 R23.1 70.78,72.7 arc-90 C13.P+
N$6
  Top 0.406: P3.2 17.46,6.35 arc-90 C6.1
N$7
  Top 0.406: U1.13 42.23,31.11 arc90 R10.1 R11.2 R12.2 R13.2
N$8
  Top 0.406: C16.+ arc90 68.9,46.67 C15.1 61.91,46.67 arc90 U3.5
N$9
  Top 0.406: C7.1 68.9,58.1 arc90 R39.1 R14.2
N$10
  Top 0.406: C8.1 60.01,58.1 arc90 R41.1 R15.2
N$11
  Top 0.406: R42.1 R16.2
N$12  (via drill 0.7)
  Top 0.406: R16.1 arc90 50.48,64.77 v48.9,64.77 | R15.1 arc90 59.37,64.77 v57.15,64.77 | R14.1 arc90 68.26,64.77 v66.04,64.77 | C9.2 v36.83,34.92
  Bottom 0.406: v66.04,64.77 v57.15,64.77 v48.9,64.77 arc90 38.73,54.61 | v36.83,34.92 arc-90 34.29,37.47 34.29,44.45 arc-90 36.83,46.99 arc90 38.73,48.9 38.73,54.61 | 42.35,62.04 V2.P$1 arc50 38.73,54.61
N$13
  Top 0.406: R42.2 C11.1
N$14
  Top 0.406: C14.1 arc-90 58.1,50.8 R24.2
N$15
  Top 0.406: C7.2 arc-90 71.11,54.29 R17.1 R39.3
N$16
  Top 0.406: C8.2 arc-90 62.23,54.29 R18.1 R41.3
N$17
  Top 0.406: R19.1 R42.3
N$18
  Top 0.406: R39.2 R20.1
N$19
  Top 0.406: R41.2 C10.1
N$20
  Top 0.406: C14.2 R25.1 51.12,46.67 V17.P$1
N$21
  Top 0.406: R27.1 47.62,47.3 | 47.62,47.3 arc-90 R25.2 | R26.1 46.67,48.26 arc-90 47.62,47.3 | D7.A D8.C 46.35,50.8 arc-90 47.62,49.53 47.62,47.3
N$22
  Top 0.406: R29.1 C15.2
N$23
  Top 0.406: R38.2 C17.2
N$24
  Top 0.406: R4.2 15.24,27.94 | 15.24,27.94 9.84,27.94 arc90 C4.2 | D4.C 14.61,28.57 arc90 15.24,27.94
N$25
  Top 0.406: C19.+ arc90 69.53,30.8 C18.1 61.28,30.8 arc90 U4.5
N$26
  Top 0.61: U2.3 52.07,67.94 arc81 54.29,69.85 arc-86 C12.P+ 60.96,71.1 R21.1 R22.1
N$27
  Top 0.406: C20.1 arc90 58.42,21.91 U4.3
N$28
  Top 0.406: C17.1 arc90 58.42,37.15 U3.3
N$29
  Top 0.406: C18.2 R30.1
N$30
  Top 0.406: C6.2 18.1,3.81 19.05,3.81 | 19.05,3.81 D6.C | R9.2 21.59,6.35 arc-90 19.05,3.81
N$31
  Top 0.406: R37.2 C20.2
N$32
  Top 1.27: D1.C arc90 6.35,45.72 F1.P$1
N$33
  Top 0.406: C5.2 19.05,12.06 arc90 20,13.02 20,14.6 arc-90 R8.2 D5.C
N$34
  Top 0.406: C24.+ arc90 69.53,15.56 C23.1 61.28,15.56 arc90 U5.5
N$35
  Top 0.406: C25.1 arc90 58.42,5.4 U5.3
N$36
  Top 0.406: C23.2 R31.1
N$37
  Top 0.406: D3.C 15.24,33.02 arc90 17.78,35.56 17.78,36.83 | R3.2 19.05,35.56 arc-90 17.78,36.83 | 17.78,36.83 C3.2
N$38
  Top 0.406: R36.2 50.8,6.35 arc-90 52.07,5.08 arc90 53.34,3.81 C25.2
N$39
  cutout Bottom: 2.54,50.8 7.62,50.8 7.62,48.26 17.78,48.26 17.78,43.18 2.54,43.18
N$40
  cutout Top: 1.91,40.01 1.91,36.2 5.71,36.2 5.71,40.01
N$41
  cutout Bottom: 3.17,59.69 3.17,65.41 6.99,65.41 6.99,59.05 3.17,59.05
N$42
  cutout Bottom: 6.35,63.5 12.06,63.5 12.06,69.22 5.71,69.22 5.71,63.5
  cutout Top: 5.71,63.5 12.06,63.5 12.06,69.22 5.71,69.22
N$43
  cutout Top: 13.34,69.22 17.14,69.22 17.14,73.03 13.34,73.03
  cutout Bottom: 13.34,69.22 17.14,69.22 17.14,73.03 13.34,73.03
N$44
  cutout Bottom: 12.06,57.78 12.06,61.59 15.88,61.59 15.88,57.78
N$45
  cutout Bottom: 17.14,57.78 17.14,61.59 20.95,61.59 20.95,57.78
  cutout Bottom: 32.38,69.85 32.38,73.66 34.92,73.66 34.92,69.85
  cutout Bottom: 41.02,60.96 41.02,63.5 43.56,63.5 43.56,60.96
N$46
  cutout Top: 17.14,53.34 17.78,53.34 23.5,53.34 23.5,55.88 20.32,55.88 20.32,58.42 17.14,58.42
N$47
  cutout Top: 20.32,50.16 20.32,53.34 23.5,53.34 23.5,50.16
N$48
  cutout Bottom: 7.62,35.56 7.62,38.1 10.16,38.1 10.16,35.56
N$49
  cutout Bottom: 12.7,38.1 12.7,40.64 15.24,40.64 15.24,38.1
N$50
  cutout Bottom: 24.13,46.99 24.13,49.53 26.67,49.53 26.67,46.99
  cutout Bottom: 24.13,50.8 24.13,53.34 26.67,53.34 26.67,50.8
  cutout Bottom: 49.53,45.09 49.53,47.62 52.07,47.62 52.07,45.09
  cutout Bottom: 43.18,10.79 43.18,13.34 45.72,13.34 45.72,10.79
N$51
  cutout Top: 1.91,27.3 1.91,20.95 5.71,20.95 5.71,27.3
N$52
  cutout Top: 1.91,6.99 5.71,6.99 5.71,13.34 1.91,13.34
N$53
  cutout Bottom: 6.99,6.99 6.99,14.61 10.79,14.61 10.79,6.99
N$54
  cutout Bottom: 12.06,4.45 12.06,8.26 15.88,8.26 15.88,4.45
N$55
  cutout Bottom: 12.06,13.34 12.06,17.14 19.05,17.14 19.05,13.34
N$56
  cutout Bottom: 19.68,1.91 19.68,5.71 23.5,5.71 23.5,5.08 23.5,1.91
N$57
  cutout Bottom: 40.64,3.81 40.64,8.89 45.72,8.89 45.72,3.81
N$58
  cutout Bottom: 40.64,15.24 40.64,20.32 45.72,20.32 45.72,15.24
N$59
  cutout Bottom: 40.64,39.37 40.64,44.45 45.09,44.45 45.09,39.37
N$60
  cutout Bottom: 40.64,49.53 40.64,54.61 44.45,54.61 44.45,49.53
N$61
  cutout Bottom: 12.7,27.94 16.51,27.94 16.51,34.92 12.7,34.92
N$62
  cutout Top: 22.23,12.06 28.57,12.06 28.57,29.84 22.23,29.84
N$63
  cutout Top: 24.13,33.66 24.13,42.55 29.21,42.55 29.21,33.66
N$64
  cutout Bottom: 54.61,69.22 58.42,69.22 58.42,73.03 54.61,73.03
  cutout Bottom: 69.22,70.48 73.03,70.48 73.03,74.3 69.22,74.3
N$65
  cutout Top: 48.26,55.88 48.26,60.96 76.2,60.96 76.2,55.88
N$66
  cutout Bottom: 62.87,48.26 51.44,48.26 51.44,43.81 51.44,43.18 62.87,43.18
  cutout Bottom: 62.87,33.02 51.44,33.02 51.44,28.57 51.44,27.94 62.87,27.94
  cutout Bottom: 62.87,17.78 51.44,17.78 51.44,13.34 51.44,12.7 62.87,12.7
N$67
  cutout Bottom: 52.07,36.2 54.61,36.2 54.61,40.01 52.07,40.01
  cutout Bottom: 52.07,20.95 54.61,20.95 54.61,24.77 52.07,24.77
  cutout Bottom: 57.15,20.95 59.69,20.95 59.69,24.77 57.15,24.77
  cutout Bottom: 52.07,5.71 54.61,5.71 54.61,9.53 52.07,9.53
  cutout Bottom: 57.15,5.71 59.69,5.71 59.69,9.53 57.15,9.53
N$68
  cutout Top: 46.99,33.02 51.44,33.02 52.7,34.29 52.7,38.73 46.99,38.73
N$69
  cutout Bottom: 57.15,36.2 59.69,36.2 59.69,40.01 57.15,40.01
N$70
  cutout Top: 68.58,17.14 68.58,20.95 74.93,20.95 74.93,17.14
N$71
  cutout Bottom: 68.58,16.51 68.58,6.35 73.66,6.35 73.66,16.51
N$72
  cutout Bottom: 68.58,21.59 73.66,21.59 73.66,31.75 68.58,31.75
  cutout Bottom: 68.58,36.83 73.66,36.83 73.66,46.99 68.58,46.99
N$73
  cutout Top: 68.58,32.38 68.58,36.2 74.93,36.2 74.93,32.38
N$74
  cutout Top: 69.22,5.71 69.22,1.91 73.03,1.91 73.03,5.71
N$75
  cutout Top: 46.99,5.08 46.99,4.45 52.07,4.45 52.07,10.79 46.99,10.79
N$76
  cutout Top: 46.99,17.14 52.07,17.14 52.07,23.5 46.99,23.5
N$77
  cutout Top: 15.88,35.56 15.88,40.64 19.68,40.64 19.68,35.56
N$78
  cutout Top: 19.05,33.66 19.05,37.47 24.13,37.47 24.13,33.66
N$79
  cutout Top: 16.51,26.04 21.59,26.04 21.59,29.84 16.51,29.84
N$80
  cutout Top: 5.08,22.86 5.08,28.57 10.16,28.57 10.16,22.86
N$81
  cutout Top: 10.16,22.23 15.24,22.23 15.24,27.3 10.16,27.3
N$82
  cutout Top: 8.26,19.68 8.26,22.86 10.79,22.86 10.79,19.68
N$83
  cutout Top: 15.24,10.16 15.24,13.97 20.32,13.97 20.32,10.16
N$84
  cutout Top: 19.68,6.35 19.68,11.43 23.5,11.43 23.5,6.35
N$85
  cutout Top: 15.88,2.54 15.88,7.62 19.68,7.62 19.68,2.54
N$86
  cutout Top: 18.41,13.97 18.41,17.14 23.5,17.14 23.5,13.97
N$87
  cutout Top: 45.09,46.35 45.09,50.16 47.62,50.16 47.62,46.35
N$88
  cutout Top: 47.62,46.99 57.78,46.99 57.78,50.8 47.62,50.8
N$89
  cutout Top: 57.15,48.9 62.87,48.9 62.87,52.7 57.15,52.7
N$90
  cutout Top: 62.23,41.27 66.04,41.27 66.04,48.26 62.23,48.26
N$91
  cutout Top: 64.77,47.62 64.77,52.07 62.87,52.07 62.87,47.62
N$92
  cutout Top: 53.98,55.88 53.98,50.8 57.78,50.8 57.78,55.88
N$93
  cutout Top: 48.9,60.96 48.9,66.04 55.24,66.04 55.24,60.96
N$94
  cutout Top: 57.78,60.96 57.78,66.04 64.14,66.04 64.14,60.96
N$95
  cutout Top: 66.67,60.96 66.67,66.04 73.03,66.04 73.03,60.96
N$96
  cutout Top: 63.5,50.8 67.31,50.8 67.31,55.24 63.5,55.24
N$97
  cutout Top: 71.75,50.8 71.75,55.88 75.56,55.88 75.56,50.8
N$98
  cutout Top: 46.35,39.37 45.72,39.37 45.72,44.45 49.53,44.45 49.53,39.37
N$99
  cutout Top: 48.9,39.37 52.07,39.37 52.07,41.91 48.9,41.91
N$100
  cutout Top: 52.07,32.64 57.15,32.64 57.15,36.2 52.07,36.2
N$101
  cutout Top: 57.15,32.38 59.69,32.38 60.96,33.02 60.96,36.2 57.15,36.2
N$102
  cutout Top: 63.5,29.21 63.5,36.83 66.04,36.83 66.04,29.21
N$103
  cutout Top: 52.07,17.78 57.15,17.78 57.15,20.32 52.07,20.32
N$104
  cutout Top: 60.96,17.78 60.96,20.32 57.15,20.32 57.15,17.78
N$105
  cutout Top: 63.5,13.97 63.5,21.59 66.04,21.59 66.04,13.97
N$106
  cutout Top: 53.34,2.54 58.42,2.54 58.42,5.08 53.34,5.08
N$107
  cutout Top: 41.91,24.13 46.99,24.13 46.99,35.56 41.91,35.56
N$108
  cutout Top: 37.47,33.66 42.55,33.66 42.55,36.2 37.47,36.2
N$109
  cutout Top (no thermals): 36.2,64.14 47.62,64.14 47.62,74.3 36.2,74.3
N$110
  cutout Top (no thermals): 29.84,23.5 41.27,23.5 41.27,33.66 29.84,33.66
N$111
  cutout Top (no thermals): 53.34,72.39 53.34,69.85 48.26,69.85 48.26,72.39
N$112
  cutout Top (no thermals): 59.69,69.85 62.23,69.85 62.23,69.22 68.58,69.22 68.58,74.3 59.69,74.3
OUT_1
  Top 0.406: U1.1 32.24,34.61 | 32.24,34.61 32.24,35.7 arc90 29.84,38.1 R33.2 | R11.1 R11.1 arc90 42.86,36.83 34.47,36.83 arc90 32.24,34.61
OUT_2  (via drill 0.7)
  Top 0.406: U1.7 v28.89,24.77 25.72,24.77 arc-90 R34.2 | R12.1 R12.1 arc-90 v42.23,23.5
  Bottom 0.406: v42.23,23.5 29.21,23.5 arc-90 28.89,23.81 v28.89,24.77
OUT_3
  Top 0.406: R35.3 29.53,13.97 arc90 33.66,18.1 arc-90 36.51,21.27 arc90 38.88,23.32 U1.8 42.23,24.77 arc90 R13.1
OUT_4
  Top 0.406: R10.2 arc90 C9.1 40.95,34.47 arc-90 U1.14
OUT_MIX
  Top 0.406: C11.2 arc90 51.12,66.67 | 51.12,66.67 U2.2 | C10.2 arc90 60.01,66.67 | 60.01,66.67 51.12,66.67 | R20.2 arc90 68.89,66.67 60.01,66.67
PWR_AMP  (via drill 0.7)
  Top 0.406: R28.1 R27.2 47.62,40.01 arc-90 v46.35,38.73
  Bottom 0.406: R36.3 arc-90 46.35,12.06 46.35,22.86 | 46.35,22.86 46.35,38.1 | 46.35,38.1 v46.35,38.73 | R37.3 47.62,21.59 arc-90 46.35,22.86 | R38.3 47.62,36.83 arc-90 46.35,38.1
XLR_IN
  Top 0.406: R5.2 arc90 5.4,25.4 | 5.4,25.4 JP2.2 | C4.1 arc-90 5.4,25.4
  Top 0.61: JP2.2 JP2.1
XLR_OUT
  Top 0.406: C16.- 71.12,35.56 | 71.12,35.56 71.12,34.92 arc-90 JP6.2 | JP6.1 72.39,34.29 arc-90 71.12,35.56

### Text on the board
Top: AC & LG
tPlace: Two Turtle / Gang
bPlace: TREB | MID | BASS | GTR IN | GTR / GAIN | XLR VOL | XLR | XLR / GAIN | XLR IN | AUX VOL | AUX | AUX / GAIN | AUX IN | GTR VOL | GTR